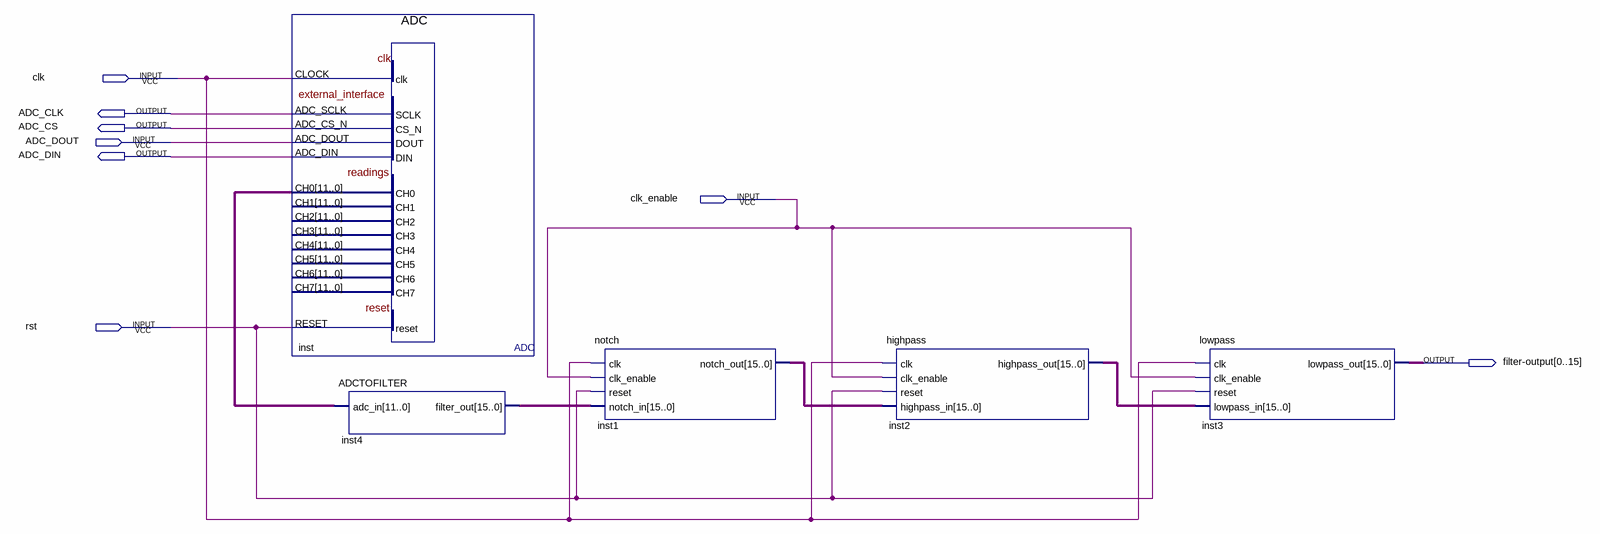
[diagram p0: schematic sheet]
// Quartus schematic DSP.bdf as structural Verilog: 5 symbols, 8 pins
module DSP (
  input  clk,
  input  ADC_DOUT,
  input  clk_enable,
  input  rst,
  output ADC_CLK,
  output ADC_CS,
  output ADC_DIN,
  output [0:15] \filter-output 
);

  wire [11:0] inst_ch0;
  wire [15:0] inst1_notch_out, inst2_highpass_out, inst4_filter_out;

  ADC inst (
    .CLOCK(clk), .ADC_DOUT(ADC_DOUT), .RESET(rst), .ADC_SCLK(ADC_CLK), .ADC_CS_N(ADC_CS), .ADC_DIN(ADC_DIN),
    .CH0(inst_ch0));  // open: CH1, CH2, CH3, CH4, CH5, CH6, CH7
  ADCTOFILTER inst4 (.adc_in(inst_ch0), .filter_out(inst4_filter_out));
  notch inst1 (
    .clk(clk), .clk_enable(clk_enable), .reset(rst), .notch_in(inst4_filter_out), .notch_out(inst1_notch_out));
  highpass inst2 (
    .clk(clk), .clk_enable(clk_enable), .reset(rst), .highpass_in(inst1_notch_out),
    .highpass_out(inst2_highpass_out));
  lowpass inst3 (
    .clk(clk), .clk_enable(clk_enable), .reset(rst), .lowpass_in(inst2_highpass_out),
    .lowpass_out(\filter-output ));
endmodule
